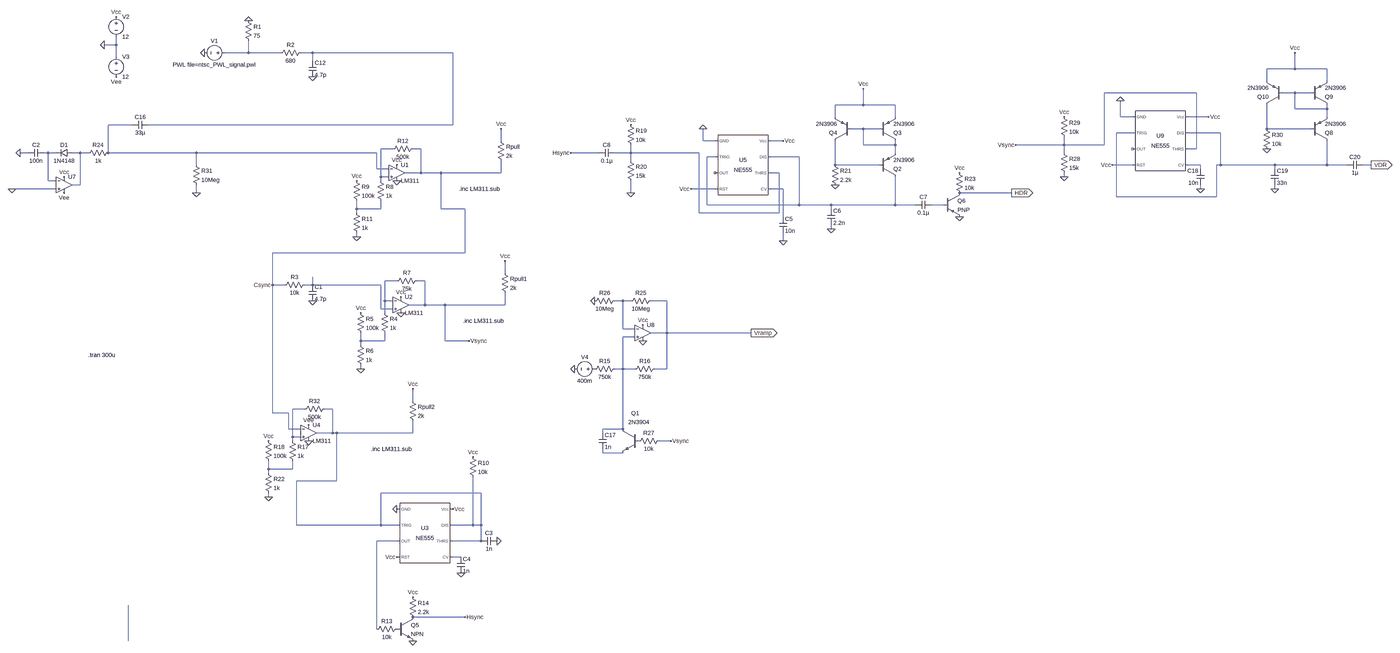
[diagram p0: schematic sixthIteration.asc, whole sheet]
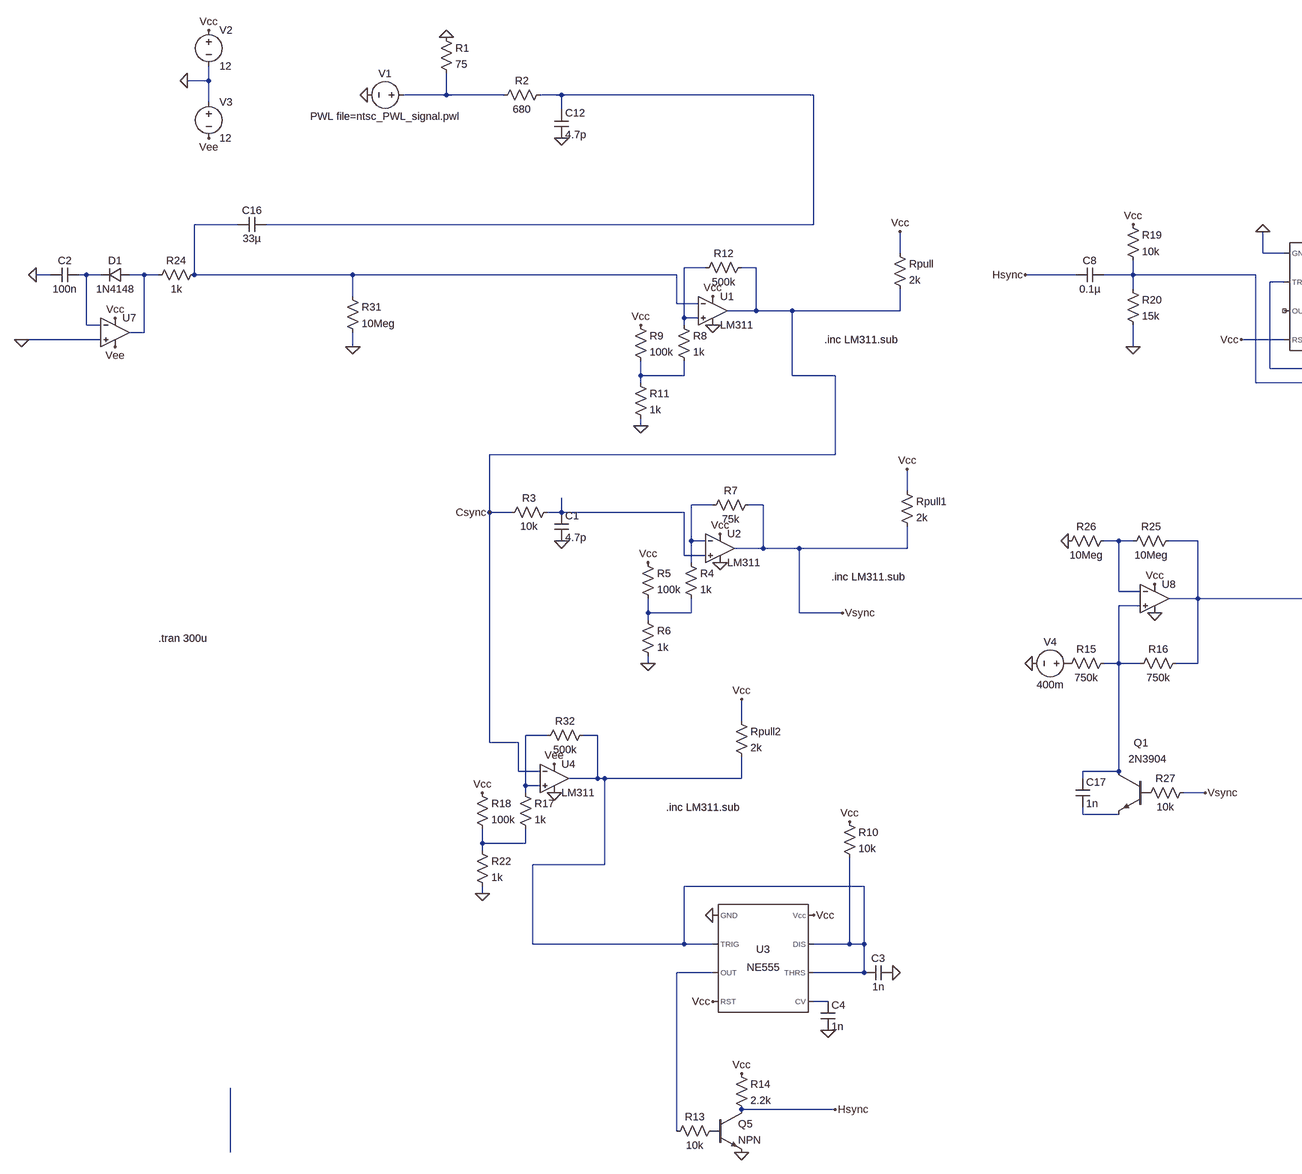
[diagram p1: schematic sixthIteration.asc, part, row 1 of 1, column 1 of 2]
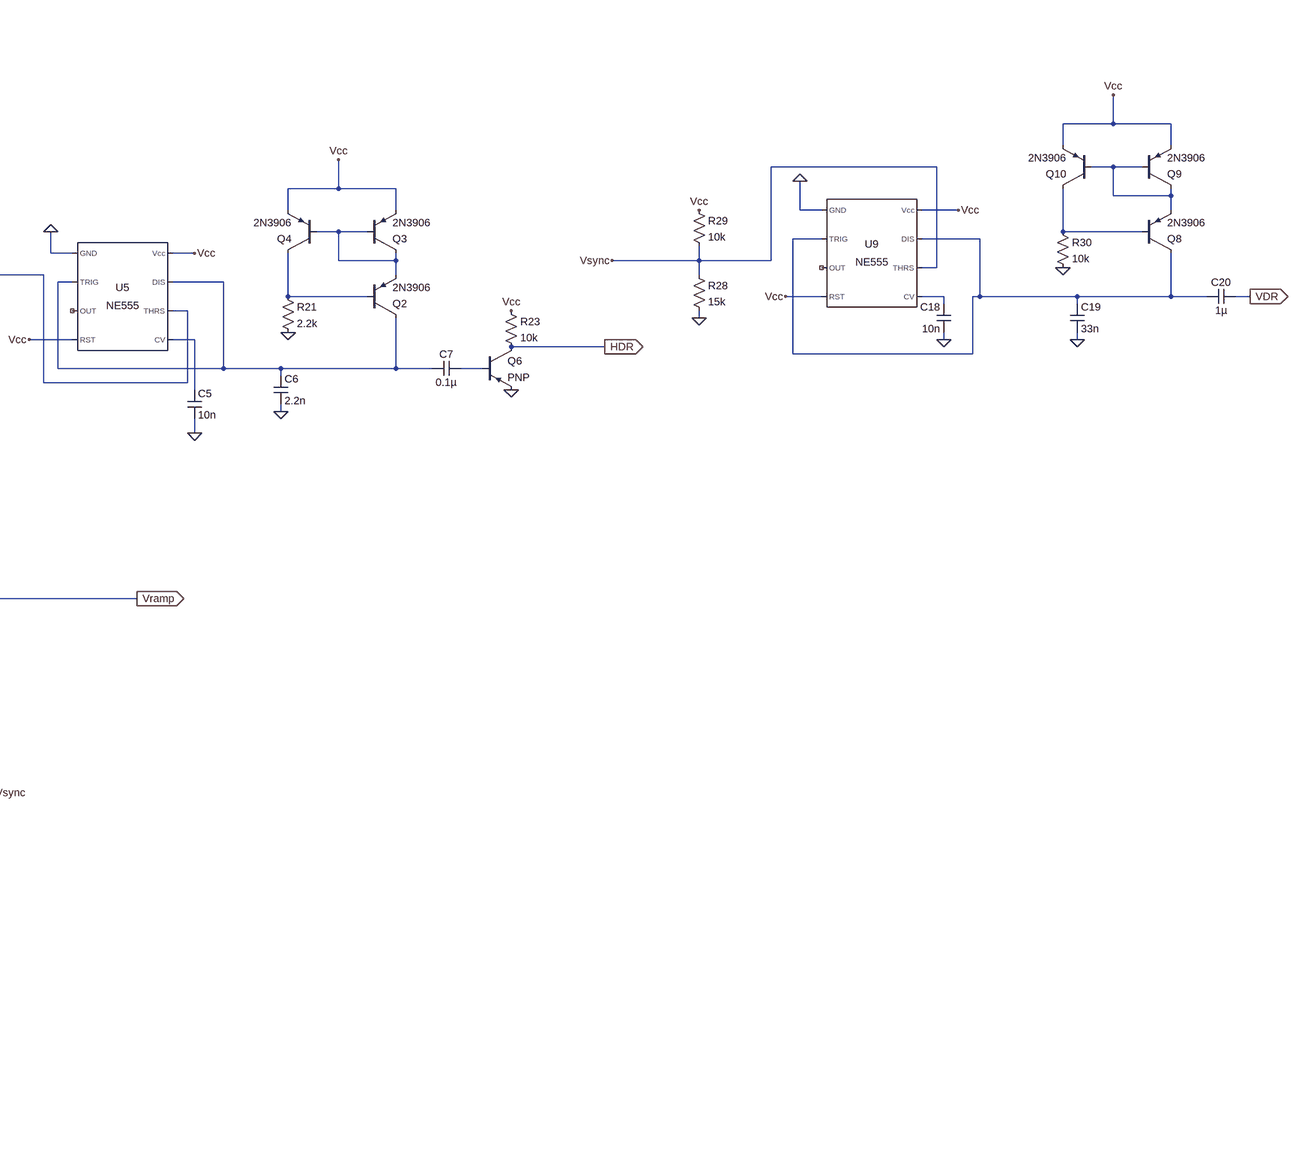
[diagram p2: schematic sixthIteration.asc, part, row 1 of 1, column 2 of 2]
sixthIteration.asc, the LTspice schematic file:
Version 4.1
SHEET 1 4812 2340
WIRE -368 -224 -368 -256
WIRE -368 -224 -416 -224
WIRE 160 -192 160 -240
WIRE 160 -192 64 -192
WIRE 288 -192 160 -192
WIRE 416 -192 368 -192
WIRE 976 -192 416 -192
WIRE -368 -176 -368 -224
WIRE 416 -160 416 -192
WIRE 4400 -128 4400 -192
WIRE 4400 -128 4288 -128
WIRE 4528 -128 4400 -128
WIRE 4288 -80 4288 -128
WIRE 4528 -80 4528 -128
WIRE 3984 -32 3616 -32
WIRE 4400 -32 4352 -32
WIRE 4464 -32 4400 -32
WIRE 2624 16 2624 -48
WIRE 2624 16 2512 16
WIRE 2752 16 2624 16
WIRE 4400 32 4400 -32
WIRE 4528 32 4528 16
WIRE 4528 32 4400 32
WIRE 2512 64 2512 16
WIRE 2752 64 2752 16
WIRE 3680 64 3680 0
WIRE 3728 64 3680 64
WIRE 4032 64 3952 64
WIRE 4528 64 4528 32
WIRE -304 96 -400 96
WIRE 976 96 976 -192
WIRE 976 96 -240 96
WIRE 2624 112 2576 112
WIRE 2688 112 2624 112
WIRE 4288 112 4288 16
WIRE 4464 112 4288 112
WIRE 3728 128 3664 128
WIRE 4080 128 3952 128
WIRE 1168 160 1168 112
WIRE 1984 160 1984 112
WIRE 2032 160 1984 160
WIRE 2304 160 2256 160
WIRE 2624 176 2624 112
WIRE 2752 176 2752 160
WIRE 2752 176 2624 176
WIRE 3456 176 3456 144
WIRE 3456 176 3232 176
WIRE 3616 176 3616 -32
WIRE 3616 176 3456 176
WIRE 736 192 688 192
WIRE 848 192 816 192
WIRE 3984 192 3984 -32
WIRE 3984 192 3952 192
WIRE -720 208 -752 208
WIRE -640 208 -656 208
WIRE -608 208 -640 208
WIRE -512 208 -544 208
WIRE -480 208 -512 208
WIRE -400 208 -400 96
WIRE -48 208 -400 208
WIRE 672 208 -48 208
WIRE 1568 208 1456 208
WIRE 1696 208 1696 176
WIRE 1696 208 1632 208
WIRE 1968 208 1696 208
WIRE 2752 208 2752 176
WIRE 3456 208 3456 176
WIRE 2032 224 2000 224
WIRE 2368 224 2256 224
WIRE 1696 240 1696 208
WIRE -48 256 -48 208
WIRE 2512 256 2512 160
WIRE 2688 256 2512 256
WIRE 3728 256 3648 256
WIRE 4000 256 3952 256
WIRE 4080 256 4080 128
WIRE 4080 256 4064 256
WIRE 4320 256 4080 256
WIRE 4528 256 4528 160
WIRE 4528 256 4320 256
WIRE 4608 256 4528 256
WIRE 4704 256 4672 256
WIRE 672 272 672 208
WIRE 720 272 672 272
WIRE 4000 272 4000 256
WIRE 4320 272 4320 256
WIRE 848 288 848 192
WIRE 848 288 784 288
WIRE 928 288 848 288
WIRE 1168 288 1168 240
WIRE 1168 288 928 288
WIRE 2288 288 2256 288
WIRE 688 304 688 192
WIRE 720 304 688 304
WIRE 3456 304 3456 288
WIRE -640 320 -640 208
WIRE -608 320 -640 320
WIRE 688 320 688 304
WIRE -512 336 -512 208
WIRE -512 336 -544 336
WIRE -784 352 -800 352
WIRE -608 352 -784 352
WIRE 2032 352 1936 352
WIRE 2304 352 2256 352
WIRE 4000 352 4000 336
WIRE 4320 352 4320 336
WIRE -48 368 -48 336
WIRE 1696 368 1696 320
WIRE 3216 368 3008 368
WIRE 3664 384 3664 128
WIRE 4064 384 4064 256
WIRE 4064 384 3664 384
WIRE 2000 416 2000 224
WIRE 2368 416 2368 224
WIRE 2368 416 2000 416
WIRE 2496 416 2368 416
WIRE 2752 416 2752 304
WIRE 2752 416 2496 416
WIRE 2832 416 2752 416
WIRE 2944 416 2896 416
WIRE 592 432 592 400
WIRE 688 432 688 400
WIRE 688 432 592 432
WIRE 928 432 928 288
WIRE 1024 432 928 432
WIRE 2496 432 2496 416
WIRE 592 448 592 432
WIRE 1968 448 1968 208
WIRE 2288 448 2288 288
WIRE 2288 448 1968 448
WIRE 2304 464 2304 352
WIRE 2496 512 2496 496
WIRE 592 544 592 528
WIRE 2304 560 2304 528
WIRE 1024 608 1024 432
WIRE 1024 608 256 608
WIRE 1184 688 1184 640
WIRE 752 720 704 720
WIRE 864 720 832 720
WIRE 256 736 256 608
WIRE 304 736 256 736
WIRE 416 736 416 704
WIRE 416 736 384 736
WIRE 688 736 416 736
WIRE 704 800 704 720
WIRE 736 800 704 800
WIRE 1664 800 1632 800
WIRE 1696 800 1664 800
WIRE 1840 800 1776 800
WIRE 864 816 864 720
WIRE 864 816 800 816
WIRE 944 816 864 816
WIRE 1184 816 1184 768
WIRE 1184 816 944 816
WIRE 688 832 688 736
WIRE 736 832 688 832
WIRE 704 848 704 800
WIRE 1664 912 1664 800
WIRE 1712 912 1664 912
WIRE 1840 928 1840 800
WIRE 1840 928 1776 928
WIRE 2176 928 1840 928
WIRE 1712 944 1664 944
WIRE 608 960 608 928
WIRE 704 960 704 928
WIRE 704 960 608 960
WIRE 944 960 944 816
WIRE 1040 960 944 960
WIRE 608 976 608 960
WIRE 608 1072 608 1056
WIRE 1664 1072 1664 944
WIRE 1664 1072 1632 1072
WIRE 1712 1072 1664 1072
WIRE 1840 1072 1840 928
WIRE 1840 1072 1792 1072
WIRE 816 1200 816 1152
WIRE 384 1232 336 1232
WIRE 496 1232 464 1232
WIRE 256 1248 256 736
WIRE 320 1248 256 1248
WIRE 320 1312 320 1248
WIRE 368 1312 320 1312
WIRE 1664 1312 1664 1072
WIRE 1664 1312 1584 1312
WIRE 496 1328 496 1232
WIRE 496 1328 432 1328
WIRE 512 1328 496 1328
WIRE 816 1328 816 1280
WIRE 816 1328 512 1328
WIRE 1584 1328 1584 1312
WIRE 336 1344 336 1232
WIRE 368 1344 336 1344
WIRE 336 1360 336 1344
WIRE 1856 1360 1808 1360
WIRE 1584 1408 1584 1392
WIRE 1664 1408 1584 1408
WIRE 240 1472 240 1440
WIRE 336 1472 336 1440
WIRE 336 1472 240 1472
WIRE 240 1488 240 1472
WIRE 512 1520 512 1328
WIRE 512 1520 352 1520
WIRE 1088 1568 688 1568
WIRE 240 1584 240 1568
WIRE 352 1696 352 1520
WIRE 688 1696 688 1568
WIRE 688 1696 352 1696
WIRE 752 1696 688 1696
WIRE 1056 1696 1056 1504
WIRE 1056 1696 976 1696
WIRE 1088 1696 1088 1568
WIRE 1088 1696 1056 1696
WIRE 752 1760 672 1760
WIRE 1088 1760 1088 1696
WIRE 1088 1760 976 1760
WIRE 1008 1824 976 1824
WIRE 1024 2064 816 2064
WIRE 672 2112 672 1760
WIRE -320 2160 -320 2016
FLAG -16 -192 0
FLAG 160 -320 0
FLAG 1696 96 Vcc
FLAG 1696 368 0
FLAG 1984 112 0
FLAG 2304 560 0
FLAG 2496 512 0
FLAG 2512 336 0
FLAG 3216 368 HDR
IOPIN 3216 368 Out
FLAG 1456 208 Hsync
FLAG 416 -96 0
FLAG 592 544 0
FLAG 752 256 Vcc
FLAG -368 -336 Vcc
FLAG -368 -96 Vee
FLAG -416 -224 0
FLAG 2304 160 Vcc
FLAG 2624 -48 Vcc
FLAG 1936 352 Vcc
FLAG 1168 112 Vcc
FLAG 592 320 Vcc
FLAG 752 320 0
FLAG -48 368 0
FLAG 416 800 0
FLAG -752 208 0
FLAG -576 368 Vee
FLAG -576 304 Vcc
FLAG -784 352 0
FLAG 608 1072 0
FLAG 768 784 Vcc
FLAG 1184 640 Vcc
FLAG 608 848 Vcc
FLAG 768 848 0
FLAG 1040 960 Vsync
FLAG 1552 800 0
FLAG 2176 928 Vramp
IOPIN 2176 928 Out
FLAG 1856 1360 Vsync
FLAG 1472 1072 0
FLAG 1744 960 0
FLAG 1744 896 Vcc
FLAG 3456 304 0
FLAG 3456 64 Vcc
FLAG 4032 64 Vcc
FLAG 3680 0 0
FLAG 4000 352 0
FLAG 3648 256 Vcc
FLAG 4288 192 0
FLAG 4400 -192 Vcc
FLAG 4320 352 0
FLAG 4704 256 VDR
IOPIN 4704 256 Out
FLAG 3232 176 Vsync
FLAG 240 1584 0
FLAG 400 1296 Vee
FLAG 816 1152 Vcc
FLAG 240 1360 Vcc
FLAG 400 1360 0
FLAG 256 736 Csync
FLAG 752 1632 0
FLAG 976 1632 Vcc
FLAG 752 1824 Vcc
FLAG 1152 1760 0
FLAG 1056 1424 Vcc
FLAG 1008 1888 0
FLAG 816 1984 Vcc
FLAG 816 2160 0
FLAG 1024 2064 Hsync
FLAG 3008 288 Vcc
FLAG 3008 464 0
DATAFLAG 592 432 ""
DATAFLAG 608 960 ""
DATAFLAG 240 1472 ""
SYMBOL voltage 80 -192 R90
WINDOW 0 -32 56 VBottom 2
WINDOW 3 32 56 VTop 2
WINDOW 123 0 0 Left 0
WINDOW 39 0 0 Left 0
SYMATTR InstName V1
SYMATTR Value PWL file=ntsc_PWL_signal.pwl
SYMBOL res 144 -336 R0
SYMATTR InstName R1
SYMATTR Value 75
SYMBOL Misc\\NE555 2144 256 R0
SYMATTR InstName U5
SYMBOL res 1680 80 R0
SYMATTR InstName R19
SYMATTR Value 10k
SYMBOL res 1680 224 R0
SYMATTR InstName R20
SYMATTR Value 15k
SYMBOL cap 2288 464 R0
SYMATTR InstName C5
SYMATTR Value 10n
SYMBOL cap 2480 432 R0
SYMATTR InstName C6
SYMATTR Value 2.2n
SYMBOL cap 2896 400 R90
WINDOW 0 0 32 VBottom 2
WINDOW 3 32 32 VTop 2
SYMATTR InstName C7
SYMATTR Value 0.1µ
SYMBOL pnp 2688 304 M180
SYMATTR InstName Q2
SYMATTR Value 2N3906
SYMBOL pnp 2688 160 M180
SYMATTR InstName Q3
SYMATTR Value 2N3906
SYMBOL pnp 2576 160 R180
SYMATTR InstName Q4
SYMATTR Value 2N3906
SYMBOL res 2496 240 R0
SYMATTR InstName R21
SYMATTR Value 2.2k
SYMBOL cap 1632 192 R90
WINDOW 0 0 32 VBottom 2
WINDOW 3 32 32 VTop 2
SYMATTR InstName C8
SYMATTR Value 0.1µ
SYMBOL res 384 -208 R90
WINDOW 0 0 56 VBottom 2
WINDOW 3 32 56 VTop 2
SYMATTR InstName R2
SYMATTR Value 680
SYMBOL cap 400 -160 R0
SYMATTR InstName C12
SYMATTR Value 4.7p
SYMBOL res 672 304 R0
SYMATTR InstName R8
SYMATTR Value 1k
SYMBOL res 576 304 R0
SYMATTR InstName R9
SYMATTR Value 100k
SYMBOL res 576 432 R0
SYMATTR InstName R11
SYMATTR Value 1k
SYMBOL res 832 176 R90
WINDOW 0 0 56 VBottom 2
WINDOW 3 32 56 VTop 2
SYMATTR InstName R12
SYMATTR Value 500k
SYMBOL res 1152 144 R0
SYMATTR InstName Rpull
SYMATTR Value 2k
SYMBOL voltage -368 -352 R0
SYMATTR InstName V2
SYMATTR Value 12
SYMBOL voltage -368 -192 R0
SYMATTR InstName V3
SYMATTR Value 12
SYMBOL OpAmps\\opamp2 752 224 R0
SYMATTR InstName U1
SYMATTR Value LM311
SYMBOL res -64 240 R0
SYMATTR InstName R31
SYMATTR Value 10Meg
SYMBOL res 400 720 R90
WINDOW 0 0 56 VBottom 2
WINDOW 3 32 56 VTop 2
SYMATTR InstName R3
SYMATTR Value 10k
SYMBOL cap 400 736 R0
SYMATTR InstName C1
SYMATTR Value 4.7p
SYMBOL res -384 192 R90
WINDOW 0 0 56 VBottom 2
WINDOW 3 32 56 VTop 2
SYMATTR InstName R24
SYMATTR Value 1k
SYMBOL diode -544 192 R90
WINDOW 0 0 32 VBottom 2
WINDOW 3 32 32 VTop 2
SYMATTR InstName D1
SYMATTR Value 1N4148
SYMBOL cap -656 192 R90
WINDOW 0 0 32 VBottom 2
WINDOW 3 32 32 VTop 2
SYMATTR InstName C2
SYMATTR Value 100n
SYMBOL OpAmps\\UniversalOpAmp2 -576 336 R0
SYMATTR InstName U7
SYMBOL cap -240 80 R90
WINDOW 0 0 32 VBottom 2
WINDOW 3 32 32 VTop 2
SYMATTR InstName C16
SYMATTR Value 33µ
SYMBOL res 688 832 R0
SYMATTR InstName R4
SYMATTR Value 1k
SYMBOL res 592 832 R0
SYMATTR InstName R5
SYMATTR Value 100k
SYMBOL res 592 960 R0
SYMATTR InstName R6
SYMATTR Value 1k
SYMBOL res 848 704 R90
WINDOW 0 0 56 VBottom 2
WINDOW 3 32 56 VTop 2
SYMATTR InstName R7
SYMATTR Value 75k
SYMBOL res 1168 672 R0
SYMATTR InstName Rpull1
SYMATTR Value 2k
SYMBOL OpAmps\\opamp2 768 752 R0
SYMATTR InstName U2
SYMATTR Value LM311
SYMBOL OpAmps\\UniversalOpAmp2 1744 928 R0
SYMATTR InstName U8
SYMBOL res 1648 1056 R90
WINDOW 0 0 56 VBottom 2
WINDOW 3 32 56 VTop 2
SYMATTR InstName R15
SYMATTR Value 750k
SYMBOL res 1808 1056 R90
WINDOW 0 0 56 VBottom 2
WINDOW 3 32 56 VTop 2
SYMATTR InstName R16
SYMATTR Value 750k
SYMBOL res 1792 784 R90
WINDOW 0 0 56 VBottom 2
WINDOW 3 32 56 VTop 2
SYMATTR InstName R25
SYMATTR Value 10Meg
SYMBOL res 1648 784 R90
WINDOW 0 0 56 VBottom 2
WINDOW 3 32 56 VTop 2
SYMATTR InstName R26
SYMATTR Value 10Meg
SYMBOL res 1824 1344 R90
WINDOW 0 0 56 VBottom 2
WINDOW 3 32 56 VTop 2
SYMATTR InstName R27
SYMATTR Value 10k
SYMBOL npn 1728 1312 M0
WINDOW 0 -2 -63 Left 2
WINDOW 3 -43 -27 Left 2
SYMATTR InstName Q1
SYMATTR Value 2N3904
SYMBOL cap 1568 1328 R0
SYMATTR InstName C17
SYMATTR Value 1n
SYMBOL voltage 1568 1072 R90
WINDOW 0 -32 56 VBottom 2
WINDOW 3 32 56 VTop 2
WINDOW 123 0 0 Left 0
WINDOW 39 0 0 Left 0
SYMATTR InstName V4
SYMATTR Value 400m
SYMBOL res 3440 192 R0
SYMATTR InstName R28
SYMATTR Value 15k
SYMBOL res 3440 48 R0
SYMATTR InstName R29
SYMATTR Value 10k
SYMBOL Misc\\NE555 3840 160 R0
SYMATTR InstName U9
SYMBOL cap 4016 336 R180
WINDOW 0 24 56 Left 2
WINDOW 3 24 8 Left 2
SYMATTR InstName C18
SYMATTR Value 10n
SYMBOL pnp 4464 160 M180
SYMATTR InstName Q8
SYMATTR Value 2N3906
SYMBOL pnp 4464 16 M180
SYMATTR InstName Q9
SYMATTR Value 2N3906
SYMBOL pnp 4352 16 R180
SYMATTR InstName Q10
SYMATTR Value 2N3906
SYMBOL res 4272 96 R0
SYMATTR InstName R30
SYMATTR Value 10k
SYMBOL cap 4304 272 R0
SYMATTR InstName C19
SYMATTR Value 33n
SYMBOL cap 4672 240 R90
WINDOW 0 0 32 VBottom 2
WINDOW 3 32 32 VTop 2
SYMATTR InstName C20
SYMATTR Value 1µ
SYMBOL res 320 1344 R0
SYMATTR InstName R17
SYMATTR Value 1k
SYMBOL res 224 1344 R0
SYMATTR InstName R18
SYMATTR Value 100k
SYMBOL res 224 1472 R0
SYMATTR InstName R22
SYMATTR Value 1k
SYMBOL res 480 1216 R90
WINDOW 0 0 56 VBottom 2
WINDOW 3 32 56 VTop 2
SYMATTR InstName R32
SYMATTR Value 500k
SYMBOL res 800 1184 R0
SYMATTR InstName Rpull2
SYMATTR Value 2k
SYMBOL OpAmps\\opamp2 400 1264 R0
SYMATTR InstName U4
SYMATTR Value LM311
SYMBOL Misc\\NE555 864 1728 R0
SYMATTR InstName U3
SYMBOL cap 1152 1744 R90
WINDOW 0 0 32 VBottom 2
WINDOW 3 32 32 VTop 2
SYMATTR InstName C3
SYMATTR Value 1n
SYMBOL res 1040 1408 R0
SYMATTR InstName R10
SYMATTR Value 10k
SYMBOL cap 992 1824 R0
SYMATTR InstName C4
SYMATTR Value 1n
SYMBOL res 768 2096 R90
WINDOW 0 0 56 VBottom 2
WINDOW 3 32 56 VTop 2
SYMATTR InstName R13
SYMATTR Value 10k
SYMBOL npn 752 2064 R0
SYMATTR InstName Q5
SYMBOL res 800 1968 R0
SYMATTR InstName R14
SYMATTR Value 2.2k
SYMBOL res 2992 272 R0
SYMATTR InstName R23
SYMATTR Value 10k
SYMBOL pnp 2944 368 R0
SYMATTR InstName Q6
TEXT -480 1016 Left 2 !.tran 300u
TEXT 1000 352 Left 2 !.inc LM311.sub
TEXT 1016 880 Left 2 !.inc LM311.sub
TEXT 648 1392 Left 2 !.inc LM311.sub

The netlist it stands for:
* sixthIteration.asc
V1 N001 0 PWL file=ntsc_PWL_signal.pwl
R1 0 N001 75
X§U5 0 N012 NC_01 Vcc N015 N011 N012 Vcc NE555  ; pins GND TRIG OUT RST CV THRS DIS Vcc
R19 Vcc N011 10k
R20 N011 0 15k
C5 N015 0 10n
C6 N012 0 2.2n
C7 N016 N012 0.1µ
Q2 N012 N013 N005 0 2N3906
Q3 N005 N005 Vcc 0 2N3906
Q4 N013 N005 Vcc 0 2N3906
R21 N013 0 2.2k
C8 N011 Hsync 0.1µ
R2 N002 N001 680
C12 N002 0 4.7p
R8 N008 N017 1k
R9 Vcc N017 100k
R11 N017 0 1k
R12 Csync N008 500k
Rpull Vcc Csync 2k
V2 Vcc 0 12
V3 0 Vee 12
X§U1 N008 N004 Vcc 0 Csync LM311  ; pins In+ In- V+ V- OUT
R31 N004 0 10Meg
R3 N019 Csync 10k
C1 N019 0 4.7p
R24 N004 N010 1k
D1 N010 N009 1N4148
C2 N009 0 100n
X§U7 0 N009 Vcc Vee N010 level2 Avol=1Meg GBW=10Meg Slew=10Meg Ilimit=25m Rail=0 Vos=0 En=0 Enk=0 In=0 Ink=0 Rin=500Meg  ; pins In+ In- V+ V- OUT
C16 N002 N004 33µ
R4 N018 N022 1k
R5 Vcc N022 100k
R6 N022 0 1k
R7 Vsync N018 75k
Rpull1 Vcc Vsync 2k
X§U2 N019 N018 Vcc 0 Vsync LM311  ; pins In+ In- V+ V- OUT
X§U8 N021 N020 Vcc 0 Vramp level2 Avol=1Meg GBW=10Meg Slew=10Meg Ilimit=25m Rail=0 Vos=0 En=0 Enk=0 In=0 Ink=0 Rin=500Meg  ; pins In+ In- V+ V- OUT
R15 N021 P001 750k
R16 Vramp N021 750k
R25 Vramp N020 10Meg
R26 N020 0 10Meg
R27 Vsync P002 10k
Q1 N021 P002 N025 0 2N3904
C17 N021 N025 1n
V4 P001 0 400m
R28 Vsync 0 15k
R29 Vcc Vsync 10k
X§U9 0 N007 NC_02 Vcc N014 Vsync N007 Vcc NE555  ; pins GND TRIG OUT RST CV THRS DIS Vcc
C18 0 N014 10n
Q8 N007 N006 N003 0 2N3906
Q9 N003 N003 Vcc 0 2N3906
Q10 N006 N003 Vcc 0 2N3906
R30 N006 0 10k
C19 N007 0 33n
C20 VDR N007 1µ
R17 N023 N026 1k
R18 Vcc N026 100k
R22 N026 0 1k
R32 N024 N023 500k
Rpull2 Vcc N024 2k
X§U4 N023 Csync Vee 0 N024 LM311  ; pins In+ In- V+ V- OUT
X§U3 0 N024 N027 Vcc N028 N024 N024 Vcc NE555  ; pins GND TRIG OUT RST CV THRS DIS Vcc
C3 0 N024 1n
R10 Vcc N024 10k
C4 N028 0 1n
R13 P003 N027 10k
Q5 Hsync P003 0 0 NPN
R14 Vcc Hsync 2.2k
R23 Vcc HDR 10k
Q6 HDR N016 0 0 PNP
.model D D
.lib standard.dio
.model NPN NPN
.model PNP PNP
.lib standard.bjt
.tran 300u
.inc LM311.sub
.inc LM311.sub
.inc LM311.sub
.lib NE555.sub
.lib UniversalOpAmp2.lib
.backanno
.end